# Altium schematic sheet LED Matrix-2.SchDoc: LED Matrix Page 2
size B; CheckedBy: Lance Bantoto; Engineer: Emily Adam; Revision: 1; SheetNumber: 2; SheetTotal: 2
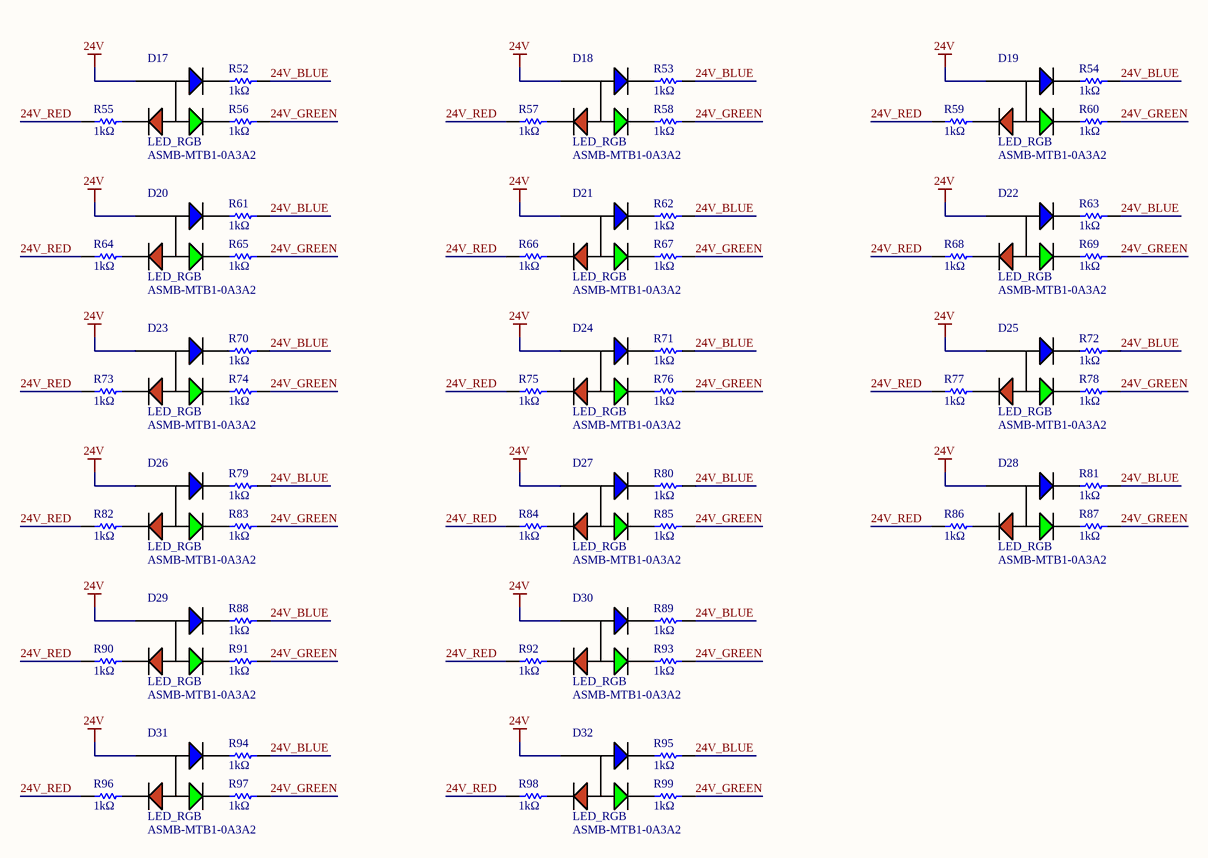
[diagram p0: LED Matrix-2.SchDoc]

## Parts
D17  LED_RGB  Manufacturer Part Number 1: ASMB-MTB1-0A3A2  [LED_RGB]
D18  LED_RGB  Manufacturer Part Number 1: ASMB-MTB1-0A3A2  [LED_RGB]
D19  LED_RGB  Manufacturer Part Number 1: ASMB-MTB1-0A3A2  [LED_RGB]
D20  LED_RGB  Manufacturer Part Number 1: ASMB-MTB1-0A3A2  [LED_RGB]
D21  LED_RGB  Manufacturer Part Number 1: ASMB-MTB1-0A3A2  [LED_RGB]
D22  LED_RGB  Manufacturer Part Number 1: ASMB-MTB1-0A3A2  [LED_RGB]
D23  LED_RGB  Manufacturer Part Number 1: ASMB-MTB1-0A3A2  [LED_RGB]
D24  LED_RGB  Manufacturer Part Number 1: ASMB-MTB1-0A3A2  [LED_RGB]
D25  LED_RGB  Manufacturer Part Number 1: ASMB-MTB1-0A3A2  [LED_RGB]
D26  LED_RGB  Manufacturer Part Number 1: ASMB-MTB1-0A3A2  [LED_RGB]
D27  LED_RGB  Manufacturer Part Number 1: ASMB-MTB1-0A3A2  [LED_RGB]
D28  LED_RGB  Manufacturer Part Number 1: ASMB-MTB1-0A3A2  [LED_RGB]
D29  LED_RGB  Manufacturer Part Number 1: ASMB-MTB1-0A3A2  [LED_RGB]
D30  LED_RGB  Manufacturer Part Number 1: ASMB-MTB1-0A3A2  [LED_RGB]
D31  LED_RGB  Manufacturer Part Number 1: ASMB-MTB1-0A3A2  [LED_RGB]
D32  LED_RGB  Manufacturer Part Number 1: ASMB-MTB1-0A3A2  [LED_RGB]
R52  1kΩ  [RESC2012X60N]
R53  1kΩ  [RESC2012X60N]
R54  1kΩ  [RESC2012X60N]
R55  1kΩ  [RESC2012X60N]
R56  1kΩ  [RESC2012X60N]
R57  1kΩ  [RESC2012X60N]
R58  1kΩ  [RESC2012X60N]
R59  1kΩ  [RESC2012X60N]
R60  1kΩ  [RESC2012X60N]
R61  1kΩ  [RESC2012X60N]
R62  1kΩ  [RESC2012X60N]
R63  1kΩ  [RESC2012X60N]
R64  1kΩ  [RESC2012X60N]
R65  1kΩ  [RESC2012X60N]
R66  1kΩ  [RESC2012X60N]
R67  1kΩ  [RESC2012X60N]
R68  1kΩ  [RESC2012X60N]
R69  1kΩ  [RESC2012X60N]
R70  1kΩ  [RESC2012X60N]
R71  1kΩ  [RESC2012X60N]
R72  1kΩ  [RESC2012X60N]
R73  1kΩ  [RESC2012X60N]
R74  1kΩ  [RESC2012X60N]
R75  1kΩ  [RESC2012X60N]
R76  1kΩ  [RESC2012X60N]
R77  1kΩ  [RESC2012X60N]
R78  1kΩ  [RESC2012X60N]
R79  1kΩ  [RESC2012X60N]
R80  1kΩ  [RESC2012X60N]
R81  1kΩ  [RESC2012X60N]
R82  1kΩ  [RESC2012X60N]
R83  1kΩ  [RESC2012X60N]
R84  1kΩ  [RESC2012X60N]
R85  1kΩ  [RESC2012X60N]
R86  1kΩ  [RESC2012X60N]
R87  1kΩ  [RESC2012X60N]
R88  1kΩ  [RESC2012X60N]
R89  1kΩ  [RESC2012X60N]
R90  1kΩ  [RESC2012X60N]
R91  1kΩ  [RESC2012X60N]
R92  1kΩ  [RESC2012X60N]
R93  1kΩ  [RESC2012X60N]
R94  1kΩ  [RESC2012X60N]
R95  1kΩ  [RESC2012X60N]
R96  1kΩ  [RESC2012X60N]
R97  1kΩ  [RESC2012X60N]
R98  1kΩ  [RESC2012X60N]
R99  1kΩ  [RESC2012X60N]

## Nets
24V: D17.4(COMMON_ANODE) D18.4(COMMON_ANODE) D19.4(COMMON_ANODE) D20.4(COMMON_ANODE) D21.4(COMMON_ANODE) D22.4(COMMON_ANODE) D23.4(COMMON_ANODE) D24.4(COMMON_ANODE) D25.4(COMMON_ANODE) D26.4(COMMON_ANODE) D27.4(COMMON_ANODE) D28.4(COMMON_ANODE) D29.4(COMMON_ANODE) D30.4(COMMON_ANODE) D31.4(COMMON_ANODE) D32.4(COMMON_ANODE)
24V_BLUE: R52.2 R53.2 R54.2 R61.2 R62.2 R63.2 R70.2 R71.2 R72.2 R79.2 R80.2 R81.2 R88.2 R89.2 R94.2 R95.2
24V_GREEN: R56.2 R58.2 R60.2 R65.2 R67.2 R69.2 R74.2 R76.2 R78.2 R83.2 R85.2 R87.2 R91.2 R93.2 R97.2 R99.2
24V_RED: R55.1 R57.1 R59.1 R64.1 R66.1 R68.1 R73.1 R75.1 R77.1 R82.1 R84.1 R86.1 R90.1 R92.1 R96.1 R98.1
NetD17_1: D17.1(CATHODE_(RED)) R55.2
NetD17_2: D17.2(CATHODE_(GREEN)) R56.1
NetD17_3: D17.3(CATHODE_(BLUE)) R52.1
NetD18_1: D18.1(CATHODE_(RED)) R57.2
NetD18_2: D18.2(CATHODE_(GREEN)) R58.1
NetD18_3: D18.3(CATHODE_(BLUE)) R53.1
NetD19_1: D19.1(CATHODE_(RED)) R59.2
NetD19_2: D19.2(CATHODE_(GREEN)) R60.1
NetD19_3: D19.3(CATHODE_(BLUE)) R54.1
NetD20_1: D20.1(CATHODE_(RED)) R64.2
NetD20_2: D20.2(CATHODE_(GREEN)) R65.1
NetD20_3: D20.3(CATHODE_(BLUE)) R61.1
NetD21_1: D21.1(CATHODE_(RED)) R66.2
NetD21_2: D21.2(CATHODE_(GREEN)) R67.1
NetD21_3: D21.3(CATHODE_(BLUE)) R62.1
NetD22_1: D22.1(CATHODE_(RED)) R68.2
NetD22_2: D22.2(CATHODE_(GREEN)) R69.1
NetD22_3: D22.3(CATHODE_(BLUE)) R63.1
NetD23_1: D23.1(CATHODE_(RED)) R73.2
NetD23_2: D23.2(CATHODE_(GREEN)) R74.1
NetD23_3: D23.3(CATHODE_(BLUE)) R70.1
NetD24_1: D24.1(CATHODE_(RED)) R75.2
NetD24_2: D24.2(CATHODE_(GREEN)) R76.1
NetD24_3: D24.3(CATHODE_(BLUE)) R71.1
NetD25_1: D25.1(CATHODE_(RED)) R77.2
NetD25_2: D25.2(CATHODE_(GREEN)) R78.1
NetD25_3: D25.3(CATHODE_(BLUE)) R72.1
NetD26_1: D26.1(CATHODE_(RED)) R82.2
NetD26_2: D26.2(CATHODE_(GREEN)) R83.1
NetD26_3: D26.3(CATHODE_(BLUE)) R79.1
NetD27_1: D27.1(CATHODE_(RED)) R84.2
NetD27_2: D27.2(CATHODE_(GREEN)) R85.1
NetD27_3: D27.3(CATHODE_(BLUE)) R80.1
NetD28_1: D28.1(CATHODE_(RED)) R86.2
NetD28_2: D28.2(CATHODE_(GREEN)) R87.1
NetD28_3: D28.3(CATHODE_(BLUE)) R81.1
NetD29_1: D29.1(CATHODE_(RED)) R90.2
NetD29_2: D29.2(CATHODE_(GREEN)) R91.1
NetD29_3: D29.3(CATHODE_(BLUE)) R88.1
NetD30_1: D30.1(CATHODE_(RED)) R92.2
NetD30_2: D30.2(CATHODE_(GREEN)) R93.1
NetD30_3: D30.3(CATHODE_(BLUE)) R89.1
NetD31_1: D31.1(CATHODE_(RED)) R96.2
NetD31_2: D31.2(CATHODE_(GREEN)) R97.1
NetD31_3: D31.3(CATHODE_(BLUE)) R94.1
NetD32_1: D32.1(CATHODE_(RED)) R98.2
NetD32_2: D32.2(CATHODE_(GREEN)) R99.1
NetD32_3: D32.3(CATHODE_(BLUE)) R95.1

## Notes on the sheet
- Title:
- Project:
- Date:
- Rev:
- Checker:
- Engineer:
- Sheet:
- of

## Library data of the parts
D17-D32 = LED_RGB: LED RGB DIFFUSED 4PLCC SMD; Manufacturer 1: Broadcom; Color: Blue,Green,Red; Lens Color: White; Viewing Angle: 115°; Lens Style: Round; Luminous Intensity: 350mcd; Dominant Wavelength: 470nm; Forward Voltage: 3.1V; Test Current: 20mA; Supplier 1: Digi-Key; Mount: Surface Mount; Case/Package: PLCC; Number of Pins: 4; Lens Transparency: Diffused; Length: 3.2mm; Height: 1.9mm; Width: 2.8mm; REACH SVHC: No SVHC; Supplier Part Number 1: 516-3280-1-ND
R52-R99 = RES_1kΩ_0805: RES SMD 1K OHM 1% 1/8W 0805; Manufacturer 1: Yageo; Manufacturer Part Number 1: RC0805FR-071KL; Power Rating: 125mW; Temperature Coefficient: 25ppm/°C; Voltage Rating: 150V; Supplier 1: Digi-Key; Case Code (Metric): 2012; Min Operating Temperature: -55°C; Max Operating Temperature: 155°C; Resistance: 1K; Tolerance: 1%; Termination: SMD/SMT; Supplier Part Number 1: 311-1.00KCRCT-ND; Case Code (Imperial): 0805; Value: 1kΩ; Package: 0805 (2012 Metric); Mount: Surface Mount; Case/Package: 0805; Number of Pins: 2; Weight: 0.000194oz; Contact Plating: Tin; Composition: Thin Film; Number of Terminations: 2; Voltage Rating (DC): 150V; Max Power Dissipation: 125mW; Features: Moisture Resistant,Automotive AEC-Q200,Anti-Sulfur; Military Standard: Not; Length: 2mm; Height: 0.022inch; Width: 0.049inch; Depth: 1.25mm; REACH SVHC: Unknown